# Altium schematic sheet SAM_E54_Xplained_Pro_Target_MCU.SchDoc: Target MCU
size A3; Organization: ATMEL Norway; Address1: Vestre Rosten 79; Address2: N-7075 TILLER; Address3: NORWAY; DocumentNumber: A09-2748; Revision: 4; SheetNumber: 3; SheetTotal: 13; PageSetup: Record=PageOptions|CenterHorizontal=True|CenterVertical=True|PrintScale=1.01|XCorrection=1.00|YCorrection=1.00|PrintKind=1|BorderSize=5000000|LeftOffset=0|BottomOffset=0|Orientation=2|PaperLength=1000|PaperWidth=1000|Scale=100|PaperSource=7|PrintQuality=-4|MediaType=1|DitherType=10|PaperKind=A3 (297 x 420 mm)|PrintScaleMode=1
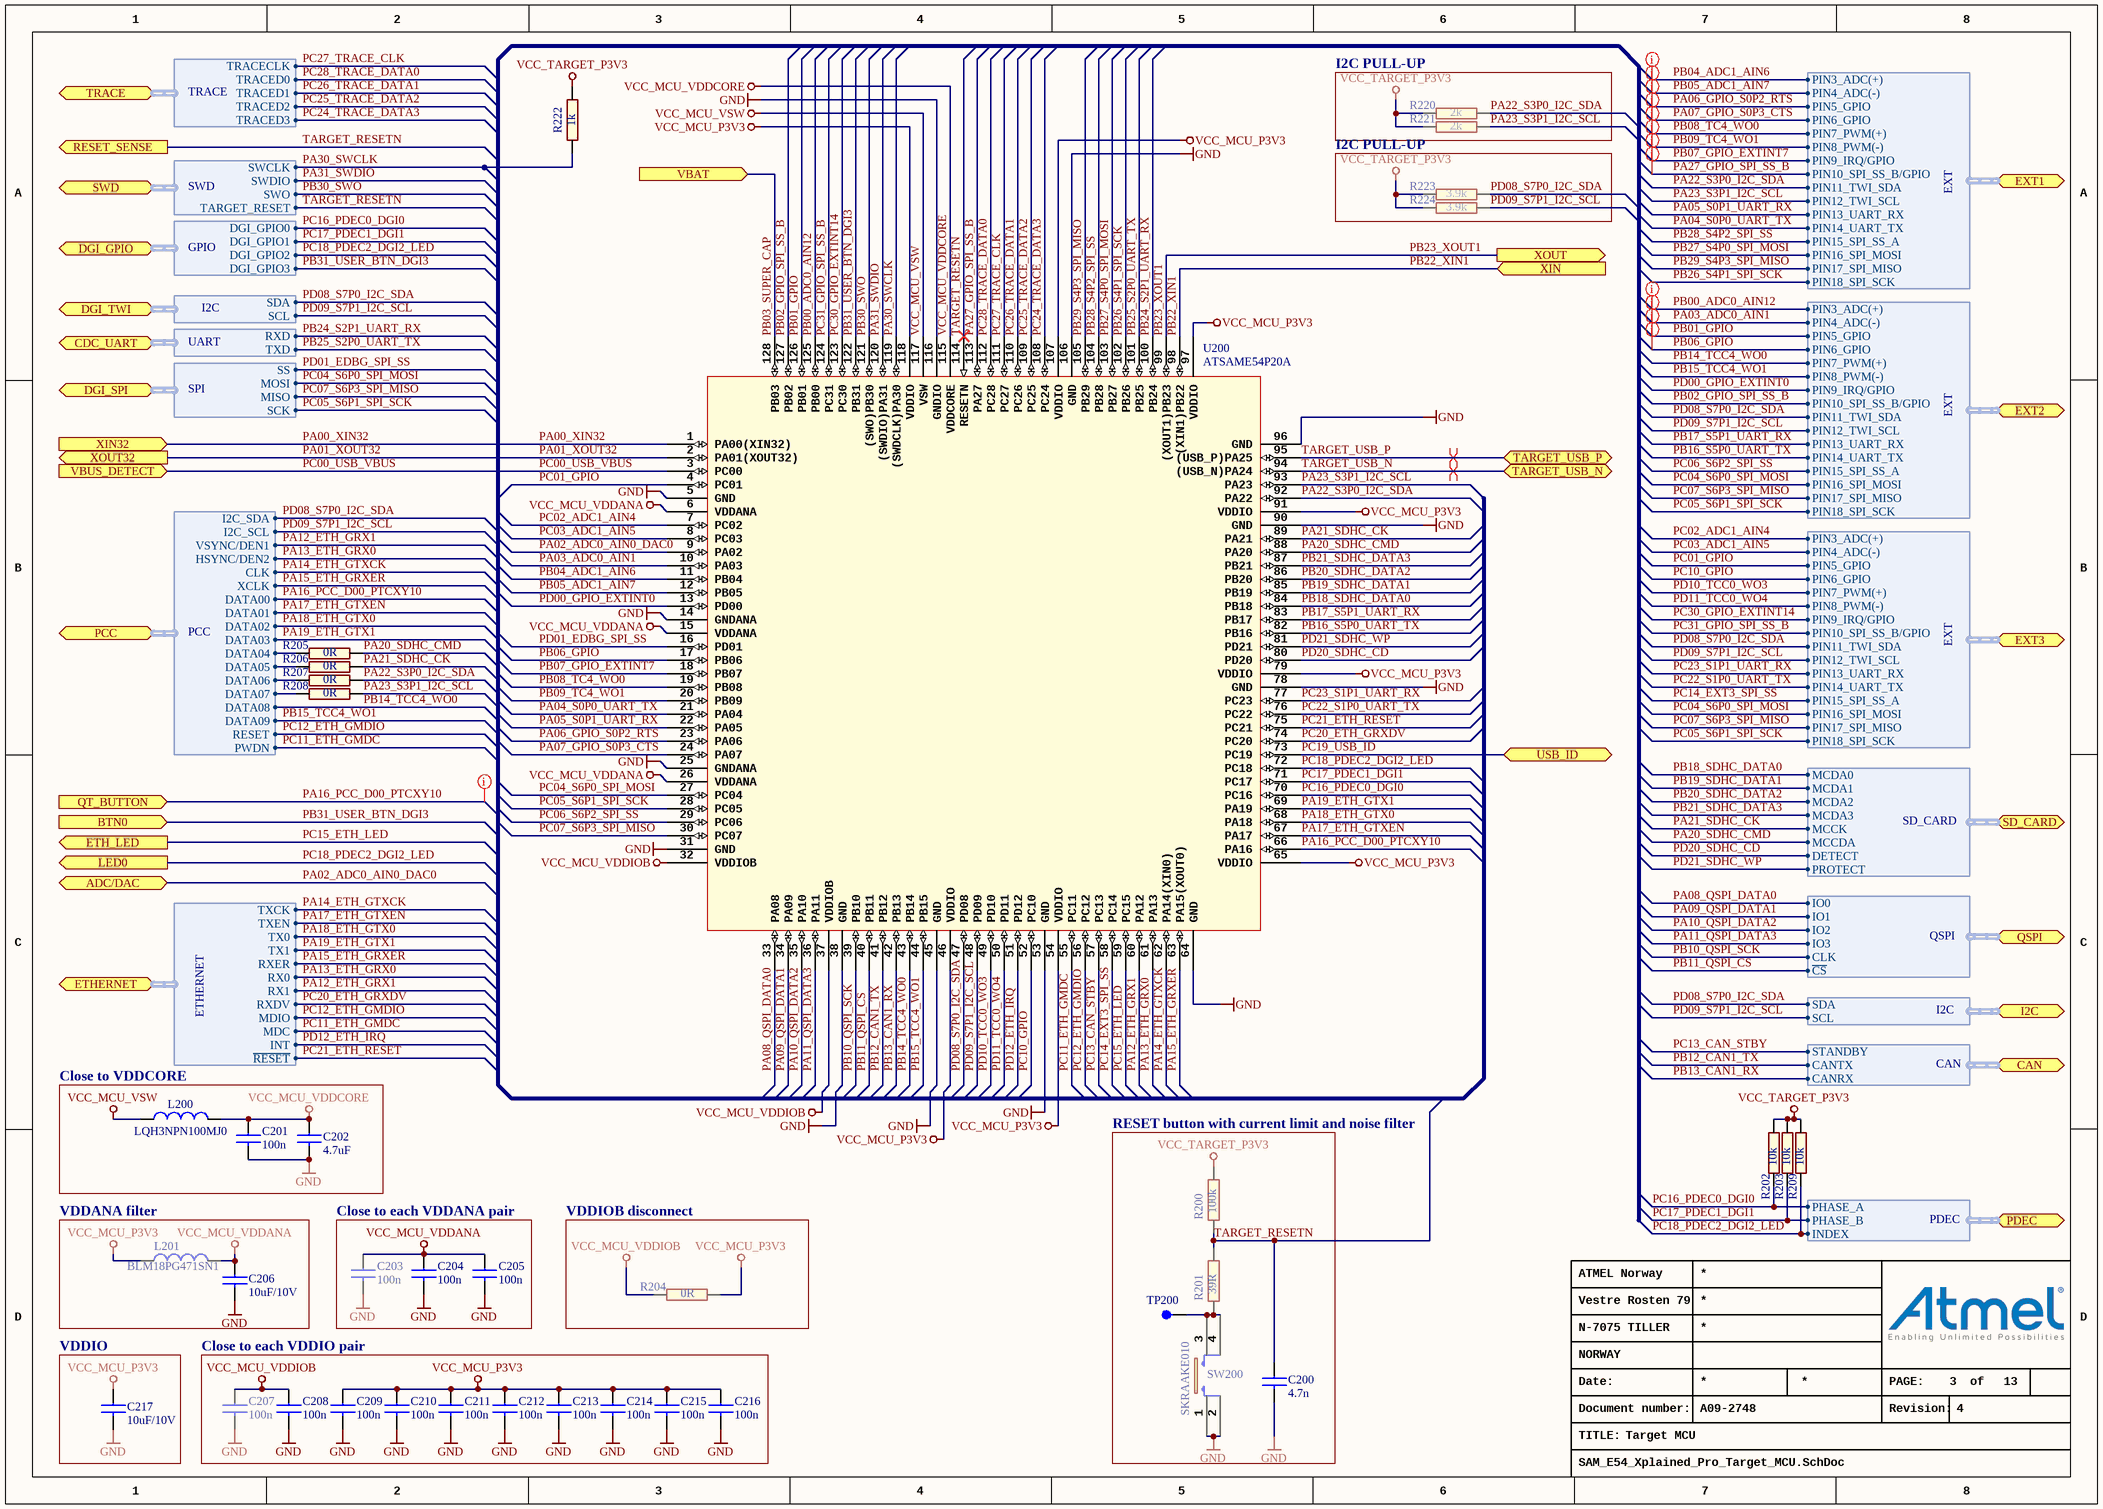
[diagram p0: SAM_E54_Xplained_Pro_Target_MCU.SchDoc]

## Parts
C200  value 4.7n  [AP1-00053]
C201  value 100n  [AP1-00053]
C202  value 4.7uF  [AP1-00117]
C203  value 100n  [AP1-00053]
C204  value 100n  [AP1-00053]
C205  value 100n  [AP1-00053]
C206  value 10uF/10V  [AP1-00117]
C207  value 100n  [AP1-00053]
C208  value 100n  [AP1-00053]
C209  value 100n  [AP1-00053]
C210  value 100n  [AP1-00053]
C211  value 100n  [AP1-00053]
C212  value 100n  [AP1-00053]
C213  value 100n  [AP1-00053]
C214  value 100n  [AP1-00053]
C215  value 100n  [AP1-00053]
C216  value 100n  [AP1-00053]
C217  value 10uF/10V  [AP1-00117]
L200  value LQH3NPN100MJ0  [AP3-00115]
L201  value BLM18PG471SN1  [AP3-00005]
R200  value 100k  [AP2-00011]
R201  value 39R  [AP2-00011]
R202  value 10k  [AP2-00011]
R203  value 10k  [AP2-00011]
R204  value 0R  [AP2-00000]
R205  value 0R  [AP2-00000]
R206  value 0R  [AP2-00000]
R207  value 0R  [AP2-00000]
R208  value 0R  [AP2-00000]
R209  value 10k  [AP2-00011]
R220  value 2k  [AP2-00011]
R221  value 2k  [AP2-00011]
R222  value 1k  [AP2-00011]
R223  value 3.9k  [AP2-00011]
R224  value 3.9k  [AP2-00011]
SW200  value SKRAAKE010  [AP8-00137]
TP200  (no value)  [AP8-00010]  (no BOM)
U200  value ATSAME54P20A  [AP6-00477]  (hidden comment: Engineering Samples)

## Blocks framed on the sheet
I2C PULL-UP: R220 R221
I2C PULL-UP: R223 R224
Close to VDDCORE: C201 C202 L200
RESET button with current limit and noise filter: C200 R200 R201 SW200 TP200
VDDANA filter: C206 L201
Close to each VDDANA pair: C203-C205
VDDIOB disconnect: R204
VDDIO: C217
Close to each VDDIO pair: C207-C216

## Ports
ADC/DAC (bidir), BTN0 (in), CAN (harness CAN), CDC_UART (harness UART), DGI_GPIO (harness GPIO), DGI_SPI (harness SPI), DGI_TWI (harness I2C), ETH_LED (out), ETHERNET (harness ETHERNET), EXT1 (harness EXT), EXT2 (harness EXT), EXT3 (harness EXT), I2C (harness I2C), LED0 (out), PCC (harness PCC), PDEC (harness PDEC), QSPI (harness QSPI), QT_BUTTON (in), RESET_SENSE (out), SD_CARD (harness SD_CARD), SWD (harness SWD), TARGET_USB_N (bidir), TARGET_USB_P (bidir), TRACE (harness TRACE), USB_ID (bidir), VBAT (in), VBUS_DETECT (in), XIN32 (in), XIN (in), XOUT32 (out), XOUT (out)

## Harnesses
GPIO: DGI_GPIO0, DGI_GPIO1, DGI_GPIO2, DGI_GPIO3
SPI: MISO, MOSI, SCK, SS
I2C: SCL, SDA
UART: RXD, TXD
EXT: PIN10_SPI_SS_B/GPIO, PIN11_TWI_SDA, PIN12_TWI_SCL, PIN13_UART_RX, PIN14_UART_TX, PIN15_SPI_SS_A, PIN16_SPI_MOSI, PIN17_SPI_MISO, PIN18_SPI_SCK, PIN3_ADC(+), PIN4_ADC(-), PIN5_GPIO, PIN6_GPIO, PIN7_PWM(+), PIN8_PWM(-), PIN9_IRQ/GPIO
I2C: SDA, SCL
SD_CARD: MCCDA, MCCK, MCDA3, MCDA2, MCDA1, MCDA0, DETECT, PROTECT
QSPI: CLK, IO3, IO2, IO0, IO1, ~{CS}
ETHERNET: TX0, TX1, TXEN, TXCK, RX0, RX1, MDC, MDIO, RXER, RXDV, INT, ~{RESET}
CAN: CANTX, CANRX, STANDBY
TRACE: TRACECLK, TRACED0, TRACED1, TRACED2, TRACED3
SWD: SWCLK, SWDIO, TARGET_RESET, SWO
PCC: VSYNC/DEN1, HSYNC/DEN2, I2C_SCL, I2C_SDA, XCLK, DATA00, CLK, DATA01, DATA02, DATA03, DATA04, DATA05, DATA06, DATA07, DATA08, DATA09, RESET, PWDN
PDEC: INDEX, PHASE_A, PHASE_B

## Nets
GND: C200.2 C201.2 C202.2 C203.2 C204.2 C205.2 C206.2 C207.2 C208.2 C209.2 C210.2 C211.2 C212.2 C213.2 C214.2 C215.2 C216.2 C217.2 SW200.1 SW200.2 U200.5(GND) U200.14(GNDANA) U200.25(GNDANA) U200.31(GND) U200.38(GND) U200.45(GND) U200.53(GND) U200.64(GND) U200.78(GND) U200.90(GND) U200.96(GND) U200.106(GND) U200.116(GNDIO)
VCC_MCU_P3V3: C209.1 C210.1 C211.1 C212.1 C213.1 C214.1 C215.1 C216.1 C217.1 L201.1 R204.1 U200.46(VDDIO) U200.54(VDDIO) U200.65(VDDIO) U200.79(VDDIO) U200.91(VDDIO) U200.97(VDDIO) U200.107(VDDIO) U200.118(VDDIO)
VCC_MCU_VDDANA: C203.1 C204.1 C205.1 C206.1 L201.2 U200.6(VDDANA) U200.15(VDDANA) U200.26(VDDANA)
VCC_MCU_VDDCORE: C201.1 C202.1 L200.2 U200.115(VDDCORE)
VCC_MCU_VDDIOB: C207.1 C208.1 R204.2 U200.32(VDDIOB) U200.37(VDDIOB)
VCC_MCU_VSW: L200.1 U200.117(VSW)
VCC_TARGET_P3V3: R200.2 R202.2 R203.1 R209.1 R220.2 R221.2 R222.2 R223.2 R224.2
PA00_XIN32: U200.1(PA00(XIN32)) ; port XIN32
PA01_XOUT32: U200.2(PA01(XOUT32)) ; port XOUT32
PA02_ADC0_AIN0_DAC0: U200.9(PA02) ; port ADC/DAC
PA03_ADC0_AIN1: U200.10(PA03) ; port EXT2.PIN4_ADC(-)
PA04_S0P0_UART_TX: U200.21(PA04) ; port EXT1.PIN14_UART_TX
PA05_S0P1_UART_RX: U200.22(PA05) ; port EXT1.PIN13_UART_RX
PA06_GPIO_S0P2_RTS: U200.23(PA06) ; port EXT1.PIN5_GPIO
PA07_GPIO_S0P3_CTS: U200.24(PA07) ; port EXT1.PIN6_GPIO
PA08_QSPI_DATA0: U200.33(PA08) ; port QSPI.IO0
PA09_QSPI_DATA1: U200.34(PA09) ; port QSPI.IO1
PA10_QSPI_DATA2: U200.35(PA10) ; port QSPI.IO2
PA11_QSPI_DATA3: U200.36(PA11) ; port QSPI.IO3
PA12_ETH_GRX1: U200.60(PA12) ; port ETHERNET.RX1, port PCC.VSYNC/DEN1
PA13_ETH_GRX0: U200.61(PA13) ; port ETHERNET.RX0, port PCC.HSYNC/DEN2
PA14_ETH_GTXCK: U200.62(PA14(XIN0)) ; port ETHERNET.TXCK, port PCC.CLK
PA15_ETH_GRXER: U200.63(PA15(XOUT0)) ; port ETHERNET.RXER, port PCC.XCLK
PA16_PCC_D00_PTCXY10: U200.66(PA16) ; port QT_BUTTON, port PCC.DATA00
PA17_ETH_GTXEN: U200.67(PA17) ; port ETHERNET.TXEN, port PCC.DATA01
PA18_ETH_GTX0: U200.68(PA18) ; port ETHERNET.TX0, port PCC.DATA02
PA19_ETH_GTX1: U200.69(PA19) ; port ETHERNET.TX1, port PCC.DATA03
PA20_SDHC_CMD: R205.1 U200.88(PA20) ; port SD_CARD.MCCDA
PA21_SDHC_CK: R206.1 U200.89(PA21) ; port SD_CARD.MCCK
PA22_S3P0_I2C_SDA: R207.1 R220.1 U200.92(PA22) ; port EXT1.PIN11_TWI_SDA
PA23_S3P1_I2C_SCL: R208.1 R221.1 U200.93(PA23) ; port EXT1.PIN12_TWI_SCL
PA27_GPIO_SPI_SS_B: U200.113(PA27) ; port EXT1.PIN10_SPI_SS_B/GPIO
PA30_SWCLK: R222.1 U200.119((SWDCLK)PA30) ; port SWD.SWCLK
PA31_SWDIO: U200.120((SWDIO)PA31) ; port SWD.SWDIO
PB00_ADC0_AIN12: U200.125(PB00) ; port EXT2.PIN3_ADC(+)
PB01_GPIO: U200.126(PB01) ; port EXT2.PIN5_GPIO
PB02_GPIO_SPI_SS_B: U200.127(PB02) ; port EXT2.PIN10_SPI_SS_B/GPIO
PB03_SUPER_CAP: U200.128(PB03) ; port VBAT
PB04_ADC1_AIN6: U200.11(PB04) ; port EXT1.PIN3_ADC(+)
PB05_ADC1_AIN7: U200.12(PB05) ; port EXT1.PIN4_ADC(-)
PB06_GPIO: U200.17(PB06) ; port EXT2.PIN6_GPIO
PB07_GPIO_EXTINT7: U200.18(PB07) ; port EXT1.PIN9_IRQ/GPIO
PB08_TC4_WO0: U200.19(PB08) ; port EXT1.PIN7_PWM(+)
PB09_TC4_WO1: U200.20(PB09) ; port EXT1.PIN8_PWM(-)
PB10_QSPI_SCK: U200.39(PB10) ; port QSPI.CLK
PB11_QSPI_CS: U200.40(PB11) ; port QSPI.~{CS}
PB12_CAN1_TX: U200.41(PB12) ; port CAN.CANTX
PB13_CAN1_RX: U200.42(PB13) ; port CAN.CANRX
PB14_TCC4_WO0: U200.43(PB14) ; port EXT2.PIN7_PWM(+), port PCC.DATA08
PB15_TCC4_WO1: U200.44(PB15) ; port EXT2.PIN8_PWM(-), port PCC.DATA09
PB16_S5P0_UART_TX: U200.82(PB16) ; port EXT2.PIN14_UART_TX
PB17_S5P1_UART_RX: U200.83(PB17) ; port EXT2.PIN13_UART_RX
PB18_SDHC_DATA0: U200.84(PB18) ; port SD_CARD.MCDA0
PB19_SDHC_DATA1: U200.85(PB19) ; port SD_CARD.MCDA1
PB20_SDHC_DATA2: U200.86(PB20) ; port SD_CARD.MCDA2
PB21_SDHC_DATA3: U200.87(PB21) ; port SD_CARD.MCDA3
PB22_XIN1: U200.98((XIN1)PB22) ; port XIN
PB23_XOUT1: U200.99((XOUT1)PB23) ; port XOUT
PB24_S2P1_UART_RX: U200.100(PB24) ; port CDC_UART.RXD
PB25_S2P0_UART_TX: U200.101(PB25) ; port CDC_UART.TXD
PB26_S4P1_SPI_SCK: U200.102(PB26) ; port EXT1.PIN18_SPI_SCK
PB27_S4P0_SPI_MOSI: U200.103(PB27) ; port EXT1.PIN16_SPI_MOSI
PB28_S4P2_SPI_SS: U200.104(PB28) ; port EXT1.PIN15_SPI_SS_A
PB29_S4P3_SPI_MISO: U200.105(PB29) ; port EXT1.PIN17_SPI_MISO
PB30_SWO: U200.121((SWO)PB30) ; port SWD.SWO
PB31_USER_BTN_DGI3: U200.122(PB31) ; port BTN0, port DGI_GPIO.DGI_GPIO3
PC00_USB_VBUS: U200.3(PC00) ; port VBUS_DETECT
PC01_GPIO: U200.4(PC01) ; port EXT3.PIN5_GPIO
PC02_ADC1_AIN4: U200.7(PC02) ; port EXT3.PIN3_ADC(+)
PC03_ADC1_AIN5: U200.8(PC03) ; port EXT3.PIN4_ADC(-)
PC04_S6P0_SPI_MOSI: U200.27(PC04) ; port DGI_SPI.MOSI, port EXT3.PIN16_SPI_MOSI, port EXT2.PIN16_SPI_MOSI
PC05_S6P1_SPI_SCK: U200.28(PC05) ; port DGI_SPI.SCK, port EXT3.PIN18_SPI_SCK, port EXT2.PIN18_SPI_SCK
PC06_S6P2_SPI_SS: U200.29(PC06) ; port EXT2.PIN15_SPI_SS_A
PC07_S6P3_SPI_MISO: U200.30(PC07) ; port DGI_SPI.MISO, port EXT3.PIN17_SPI_MISO, port EXT2.PIN17_SPI_MISO
PC10_GPIO: U200.52(PC10) ; port EXT3.PIN6_GPIO
PC11_ETH_GMDC: U200.55(PC11) ; port ETHERNET.MDC, port PCC.PWDN
PC12_ETH_GMDIO: U200.56(PC12) ; port ETHERNET.MDIO, port PCC.RESET
PC13_CAN_STBY: U200.57(PC13) ; port CAN.STANDBY
PC14_EXT3_SPI_SS: U200.58(PC14) ; port EXT3.PIN15_SPI_SS_A
PC15_ETH_LED: U200.59(PC15) ; port ETH_LED
PC16_PDEC0_DGI0: R202.1 U200.70(PC16) ; port DGI_GPIO.DGI_GPIO0, port PDEC.PHASE_A
PC17_PDEC1_DGI1: R203.2 U200.71(PC17) ; port DGI_GPIO.DGI_GPIO1, port PDEC.PHASE_B
PC18_PDEC2_DGI2_LED: R209.2 U200.72(PC18) ; port LED0, port DGI_GPIO.DGI_GPIO2, port PDEC.INDEX
PC19_USB_ID: U200.73(PC19) ; port USB_ID
PC20_ETH_GRXDV: U200.74(PC20) ; port ETHERNET.RXDV
PC21_ETH_RESET: U200.75(PC21) ; port ETHERNET.~{RESET}
PC22_S1P0_UART_TX: U200.76(PC22) ; port EXT3.PIN14_UART_TX
PC23_S1P1_UART_RX: U200.77(PC23) ; port EXT3.PIN13_UART_RX
PC24_TRACE_DATA3: U200.108(PC24) ; port TRACE.TRACED3
PC25_TRACE_DATA2: U200.109(PC25) ; port TRACE.TRACED2
PC26_TRACE_DATA1: U200.110(PC26) ; port TRACE.TRACED1
PC27_TRACE_CLK: U200.111(PC27) ; port TRACE.TRACECLK
PC28_TRACE_DATA0: U200.112(PC28) ; port TRACE.TRACED0
PC30_GPIO_EXTINT14: U200.123(PC30) ; port EXT3.PIN9_IRQ/GPIO
PC31_GPIO_SPI_SS_B: U200.124(PC31) ; port EXT3.PIN10_SPI_SS_B/GPIO
PD00_GPIO_EXTINT0: U200.13(PD00) ; port EXT2.PIN9_IRQ/GPIO
PD01_EDBG_SPI_SS: U200.16(PD01) ; port DGI_SPI.SS
PD08_S7P0_I2C_SDA: R223.1 U200.47(PD08) ; port DGI_TWI.SDA, port EXT3.PIN11_TWI_SDA, port EXT2.PIN11_TWI_SDA, port I2C.SDA, port PCC.I2C_SDA
PD09_S7P1_I2C_SCL: R224.1 U200.48(PD09) ; port DGI_TWI.SCL, port EXT3.PIN12_TWI_SCL, port EXT2.PIN12_TWI_SCL, port I2C.SCL, port PCC.I2C_SCL
PD10_TCC0_WO3: U200.49(PD10) ; port EXT3.PIN7_PWM(+)
PD11_TCC0_WO4: U200.50(PD11) ; port EXT3.PIN8_PWM(-)
PD12_ETH_IRQ: U200.51(PD12) ; port ETHERNET.INT
PD20_SDHC_CD: U200.80(PD20) ; port SD_CARD.DETECT
PD21_SDHC_WP: U200.81(PD21) ; port SD_CARD.PROTECT
TARGET_RESETN: C200.1 R200.1 R201.2 U200.114(RESETN) ; port RESET_SENSE, port SWD.TARGET_RESET
TARGET_USB_N: U200.94((USB_N)PA24) ; port TARGET_USB_N
TARGET_USB_P: U200.95((USB_P)PA25) ; port TARGET_USB_P
NetR201_1: R201.1 SW200.3 SW200.4 TP200.1
NetR205_2: R205.2 ; port PCC.DATA04
NetR206_2: R206.2 ; port PCC.DATA05
NetR207_2: R207.2 ; port PCC.DATA06
NetR208_2: R208.2 ; port PCC.DATA07

## Layout directives
differential pair: TARGET_USB_N, TARGET_USB_P
net class QTouch: PA03_ADC0_AIN1, PA06_GPIO_S0P2_RTS, PA07_GPIO_S0P3_CTS, PA16_PCC_D00_PTCXY10, PA27_GPIO_SPI_SS_B, PB00_ADC0_AIN12, PB01_GPIO, PB04_ADC1_AIN6, PB05_ADC1_AIN7, PB06_GPIO, PB07_GPIO_EXTINT7, PB08_TC4_WO0, PB09_TC4_WO1

## Notes on the sheet
- Date:
- PAGE:
- of
- TITLE:
- Document number:
- Revision:

## Library data of the parts
C200 = A01-0046: Ceramic capacitor, SMD 0402, X7R, 25V, +/-10% (de35287); PartGroup: Capacitors,Ceramic,SMD 0402; Manufacturer: PHYCOMP; MPN: 2238 587 15632; TemperatureRange: -55 - +125 deg C; AN: A01-0046; Tolerance: 25V, +/-10%; Height: 0,550000011920929
C201 C203-C205 C207-C216 = A01-0246: Ceramic capacitor, SMD 0402, X7R, 16V, +/-10%; PartGroup: Capacitors,Ceramic,SMD 0402; Manufacturer: Kemet; MPN: C0402C104K4RACTU; TemperatureRange: -55 - +125 deg C; AN: A01-0246; Tolerance: 16V, +/-10%; Height: 0,5
C202 = A01-0377: Ceramic capacitor, SMD 0603, X5R, 10V, 10% (de31036); PartGroup: Capacitors,Ceramic,SMD 0603; Manufacturer: WALSIN Technology Corporation; MPN: 0603X475K100CT; TemperatureRange: -55 - +85 deg C; AN: A01-0377; Tolerance: 10%; Height: 0,800000011920929
C206 C217 = A01-0461: Ceramic capacitor, SMD 0603, X5R, 10V, 10UF Â± 20%; PartGroup: Capacitors,Ceramic,SMD 0603; Manufacturer: AVX; MPN: 0603ZD106MAT2A; Tolerance: Â± 20%; TemperatureRange: -55Â°C to +85Â°C; AN: A01-0461
L200 = A03-0191: 10uH power inductor, Isat = 560mA , Itemp = 710mA, Rdc = 0.360ohm; PartGroup: Inductors,Power Inductors; Manufacturer: Murata; Tolerance: Â±20%; TemperatureRange: -40 - 85Â°C; AN: A03-0191; Height: 1,10000002384186; MPN: LQH3NPN100MJ0
L201 = A03-0035: SMD RF inductor 0603. Z=470Ohm (@100MHz), Max R(dc)=0.65Ohm, Max current=1A; PartGroup: Inductors,EMI; Manufacturer: Murata; TemperatureRange: -55; AN: A03-0035; Height: 0,800000011920929; MPN: BLM18PG471SN1
R200 = A02-0260: Thick film resistor, SMD 0402, 1/16W, 1%; PartGroup: Resistors,SMD,0402 1%; Manufacturer: ASJ; MPN: CR10-1003-FK; TemperatureRange: -55ï¿½ to +125ï¿½C; AN: A02-0260; Tolerance: 1 %; Height: 0,349999994039536
R201 = A02-0178: Thick film resistor, SMD 0402, 1/16W, 1%; PartGroup: Resistors,SMD,0402 1%; Manufacturer: ASJ; MPN: CR10-39R0-FK; TemperatureRange: -55 - +125 deg C; AN: A02-0178; Tolerance: 1 %; Height: 0,349999994039536
R202 R203 R209 = A02-0236: Thick film resistor, SMD 0402, 1/16W, 1%; PartGroup: Resistors,SMD,0402 1%; Manufacturer: vishay; MPN: CRCW040210K0FKED; TemperatureRange: -55 - +125 deg C; AN: A02-0236; Tolerance: 1 %; Height: 0,349999994039536
R204-R208 = A02-0163: RES 0.0 OHM 1/16W 0402 SMD; PartGroup: Resistors,SMD,0402 1%; Manufacturer: (n/a); MPN: RMCF0402ZT0R00; Tolerance: 1 %; TemperatureRange: -55 - +125 deg C; AN: A02-0163; Height: 0,349999994039536
R220 R221 = A02-0219: Thick film resistor, SMD 0402, 1/16W, 1%; PartGroup: Resistors,SMD,0402 1%; TemperatureRange: -55 - +125 deg C; AN: A02-0219; Tolerance: 1 %; Height: 0,349999994039536
R222 = A02-0212: Thick film resistor, SMD 0402, 1/16W, 1%; PartGroup: Resistors,SMD,0402 1%; Manufacturer: ASJ; MPN: CR10-1001-FK; TemperatureRange: -55 - +125 deg C; AN: A02-0212; Tolerance: 1 %; Height: 0,349999994039536
R223 R224 = A02-0226: Thick film resistor, SMD 0402, 1/16W, 1%; PartGroup: Resistors,SMD,0402 1%; TemperatureRange: -55 - +125 deg C; AN: A02-0226; Tolerance: 1 %; Height: 0,349999994039536
SW200 = A08-0790: 6.2x6.2 mm SMD tact switch, same as A08-0091 but less force is needed; PartGroup: Mechanical devices,Switches,SMD; Manufacturer: ALPS; TemperatureRange: -30 - +90 deg C; AN: A08-0790; Height: 5,09999990463257; MPN: SKRAAKE010
TP200 = A08-0004: Single SMD testpad; PartGroup: Mechanical devices,Connectors,Test points; AN: A08-0004; Value: TESTPAD; Height: 0
U200 = A06-1466: Atmel 32-bit RISC MCU; PartGroup: Integrated Circuits,MCU, MPU, DSP,ARM MCU; MPN: ATSAME54P20A-ANTES; TemperatureRange: -40Â°C +105Â°C; AN: A06-1466; Height: 1,20000004768372; Manufacturer: ATMEL